# Altium project ESP32_project.PrjPcb
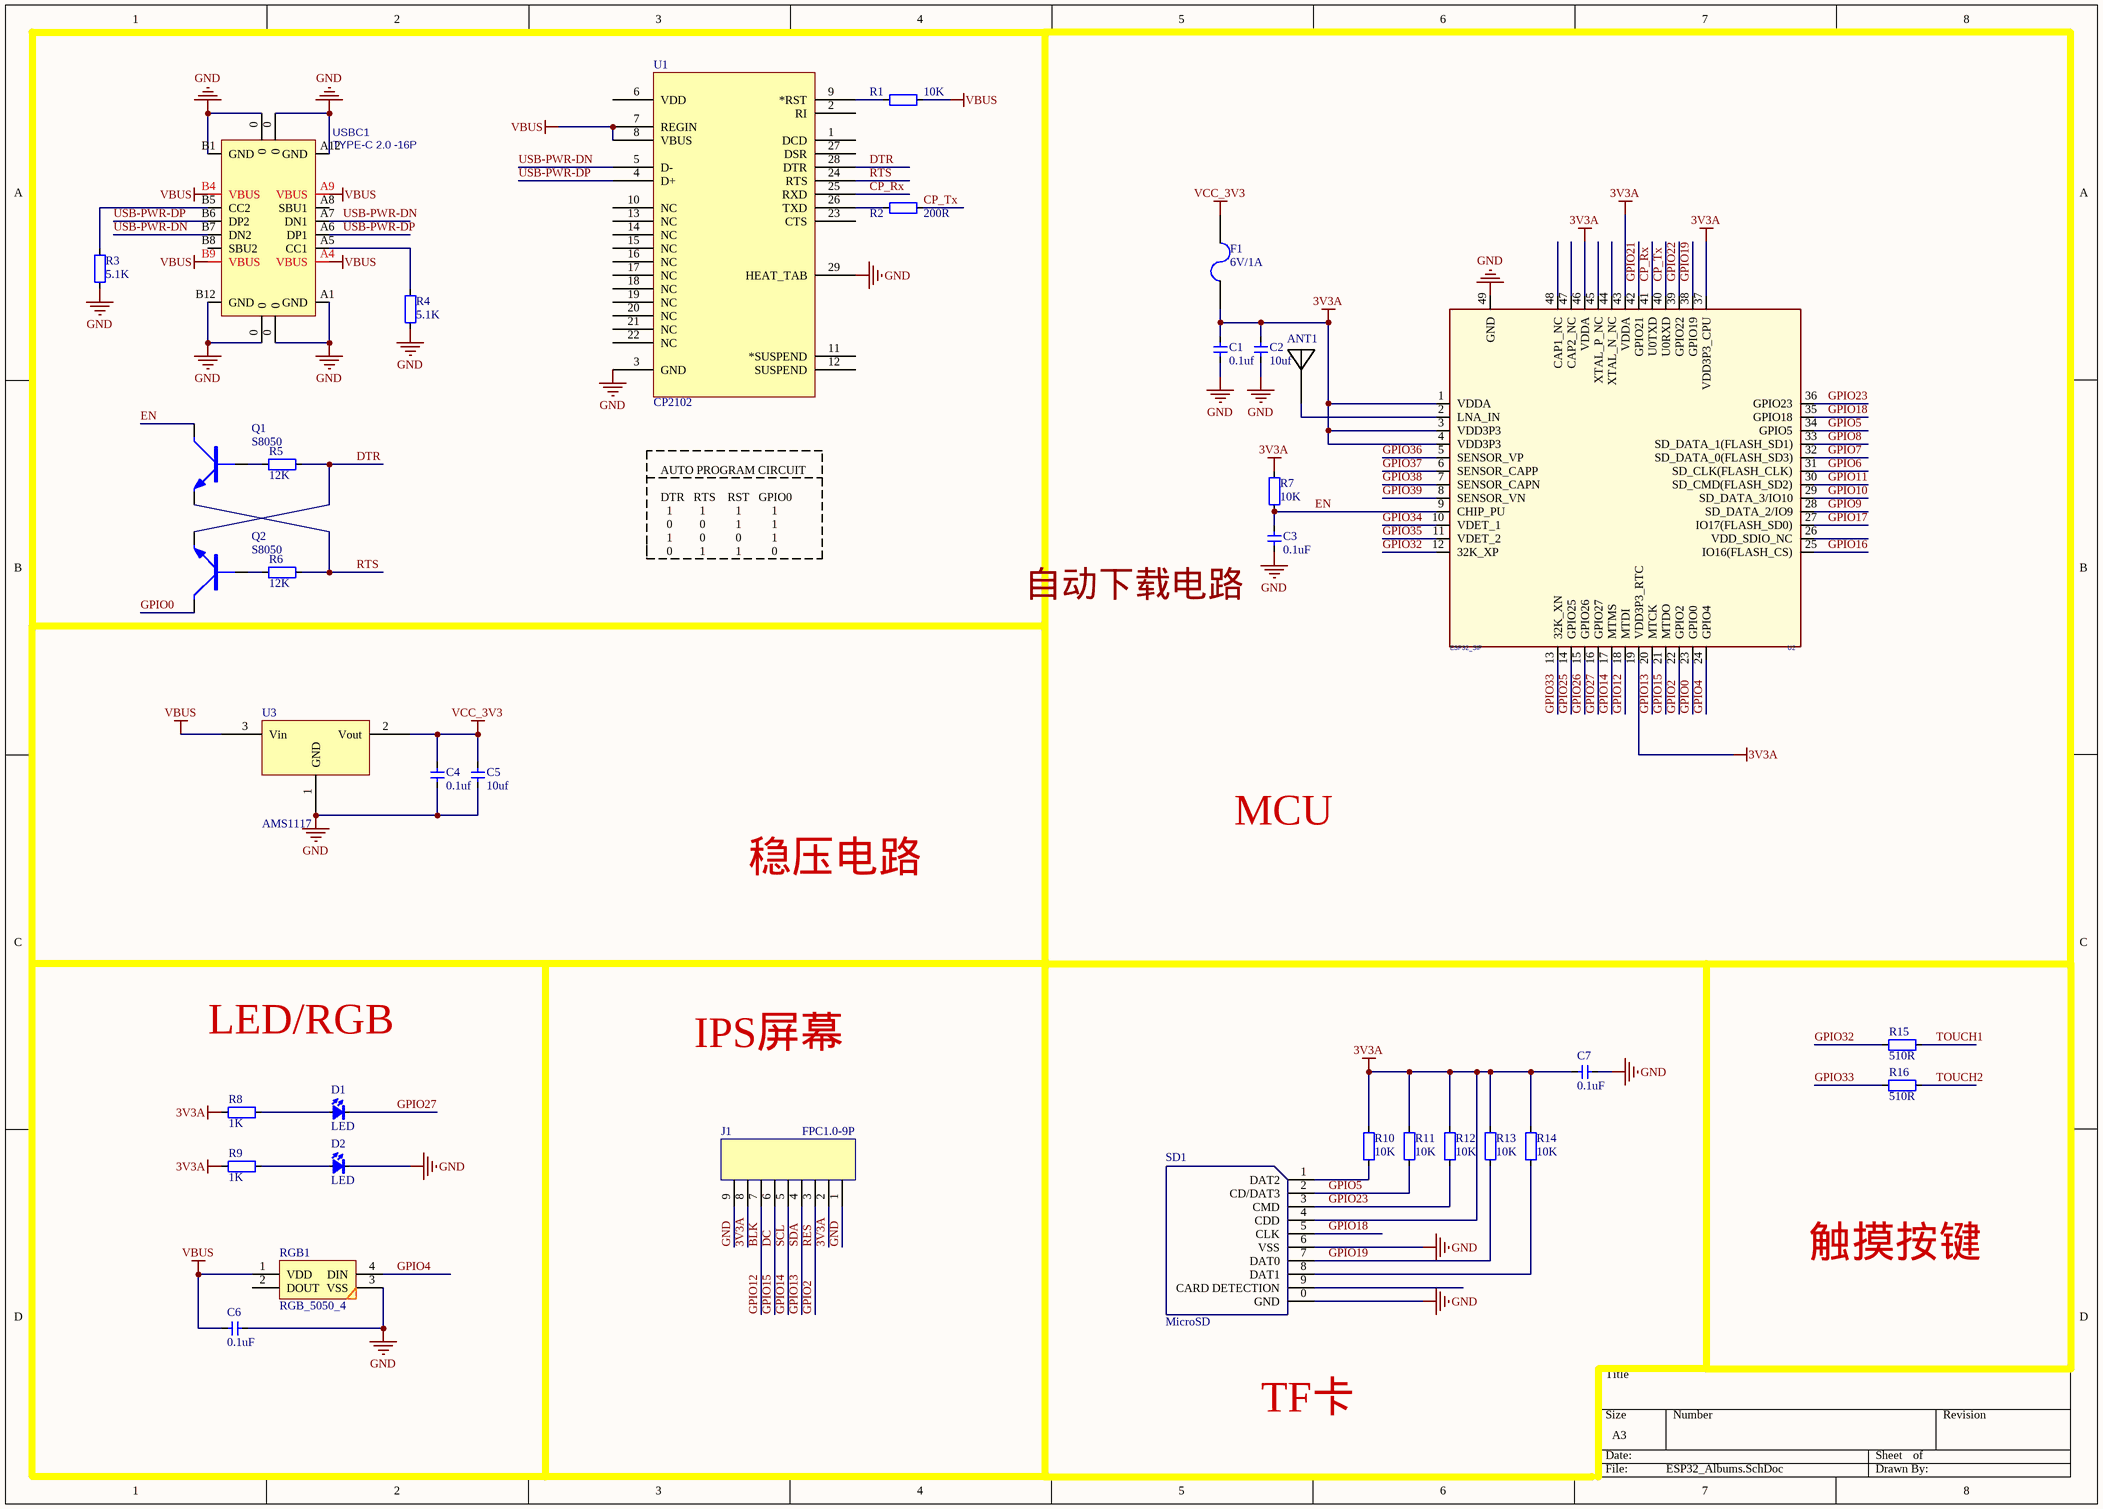
[diagram p0: ESP32_Albums.SchDoc]
1 sheet, 36 parts. Net scope: global (net labels, ports and power ports of the same name join across sheets).
Board file: ESP32_Albums.PcbDoc

## Sheet ESP32_Albums.SchDoc
size A3

### Parts
ANT1  ANT2  [ANT2051]  (value not drawn)
C1  0.1uf  [0603C]
C2  10uf  [0603C]
C3  0.1uF  [0603C]
C4  0.1uf  [0603C]
C5  10uf  [0603C]
C6  0.1uF  [0603C]
C7  0.1uF  [0603C]
D1  LED  [LED_0603_R]
D2  LED  [LED_0603_R]
F1  6V/1A  [FUSE-0805]
J1  FPC1.0-9P  [FPC1.0-9P]
Q1  S8050  [SOT-23]
Q2  S8050  [SOT-23]
R1  10K  [0603R]
R2  200R  [0603R]
R3  5.1K  [0603R]
R4  5.1K  [0603R]
R5  12K  [0603R]
R6  12K  [0603R]
R7  10K  [0603R]
R8  1K  [0603R]
R9  1K  [0603R]
R10  10K  [0603R]
R11  10K  [0603R]
R12  10K  [0603R]
R13  10K  [0603R]
R14  10K  [0603R]
R15  510R  [0603R]
R16  510R  [0603R]
RGB1  RGB_5050_4  [RGB_5050_4]
SD1  MicroSD  [Micro SD]
U1  CP2102  [LC-QFN-28_5x5x05P]
U2  ESP32_SIP  [QFN-48_7X7]
U3  AMS1117  [SOT223]
USBC1  TYPE-C 2.0 -16P  [USB-C-SMD_16P]

### Nets
3V3A: C1.2 C2.2 C7.1 F1.1 J1.2 J1.8 R7.2 R8.1 R9.1 R10.2 R11.2 R12.2 R13.2 R14.2 SD1.4(CDD) U2.1(VDDA) U2.3(VDD3P3) U2.4(VDD3P3) U2.19(VDD3P3_RTC) U2.37(VDD3P3_CPU) U2.43(VDDA) U2.46(VDDA)
GND: C1.1 C2.1 C3.1 C4.1 C5.1 C6.2 C7.2 D2.1(A) J1.1 J1.9 R3.1 R4.1 RGB1.3(VSS) SD1.0(GND) SD1.6(VSS) U1.3(GND) U1.29(HEAT_TAB) U2.49(GND) U3.1(GND) USBC1.0 USBC1.A1(GND) USBC1.A12(GND) USBC1.B1(GND) USBC1.B12(GND)
VBUS: C6.1 R1.2 RGB1.1(VDD) U1.7(REGIN) U1.8(VBUS) U3.3(Vin) USBC1.A4(VBUS) USBC1.A9(VBUS) USBC1.B4(VBUS) USBC1.B9(VBUS)
VCC_3V3: C4.2 C5.2 F1.2 U3.2(Vout)
BLK: J1.7 U2.18(MTDI)  [also labelled GPIO12]
CP_Rx: U1.25(RXD) U2.41(U0TXD)
CP_Tx: R2.2 U2.40(U0RXD)
DC: J1.6 U2.21(MTDO)  [also labelled GPIO15]
DTR: Q2.E R5.2 U1.28(DTR)
EN: C3.2 Q1.C R7.1 U2.9(CHIP_PU)
GPIO0: Q2.C U2.23(GPIO0)
GPIO2: J1.3 U2.22(GPIO2)  [also labelled RES]
GPIO4: RGB1.4(DIN) U2.24(GPIO4)
GPIO5: R11.1 SD1.2(CD/DAT3) U2.34(GPIO5)
GPIO6: U2.31(SD_CLK(FLASH_CLK))
GPIO7: U2.32(SD_DATA_0(FLASH_SD3))
GPIO8: U2.33(SD_DATA_1(FLASH_SD1))
GPIO9: U2.28(SD_DATA_2/IO9)
GPIO10: U2.29(SD_DATA_3/IO10)
GPIO11: U2.30(SD_CMD(FLASH_SD2))
GPIO13: J1.4 U2.20(MTCK)  [also labelled SDA]
GPIO14: J1.5 U2.17(MTMS)  [also labelled SCL]
GPIO16: U2.25(IO16(FLASH_CS))
GPIO17: U2.27(IO17(FLASH_SD0))
GPIO18: SD1.5(CLK) U2.35(GPIO18)
GPIO19: R13.1 SD1.7(DAT0) U2.38(GPIO19)
GPIO21: U2.42(GPIO21)
GPIO22: U2.39(GPIO22)
GPIO23: R12.1 SD1.3(CMD) U2.36(GPIO23)
GPIO25: U2.14(GPIO25)
GPIO26: U2.15(GPIO26)
GPIO27: D1.1(A) U2.16(GPIO27)
GPIO32: R15.1 U2.12(32K_XP)
GPIO33: R16.1 U2.13(32K_XN)
GPIO34: U2.10(VDET_1)
GPIO35: U2.11(VDET_2)
GPIO36: U2.5(SENSOR_VP)
GPIO37: U2.6(SENSOR_CAPP)
GPIO38: U2.7(SENSOR_CAPN)
GPIO39: U2.8(SENSOR_VN)
RTS: Q1.E R6.2 U1.24(RTS)
TOUCH1: R15.2
TOUCH2: R16.2
USB-PWR-DN: U1.5(D-) USBC1.A7(DN1) USBC1.B7(DN2)
USB-PWR-DP: U1.4(D+) USBC1.A6(DP1) USBC1.B6(DP2)
NetANT1_1: ANT1.1 U2.2(LNA_IN)
NetD1_2: D1.2(K) R8.2
NetD2_2: D2.2(K) R9.2
NetQ1_B: Q1.B R5.1
NetQ2_B: Q2.B R6.1
NetR1_1: R1.1 U1.9(*RST)
NetR2_1: R2.1 U1.26(TXD)
NetR3_2: R3.2 USBC1.B5(CC2)
NetR4_2: R4.2 USBC1.A5(CC1)
NetR10_1: R10.1 SD1.1(DAT2)
NetR14_1: R14.1 SD1.8(DAT1)

Not connected (* = marked no-connect by the designer): RGB1 2(DOUT); SD1 9(CARD_DETECTION); U1 1(DCD) 2(RI) 6(VDD) 10(NC) 11(*SUSPEND) 12(SUSPEND) 13(NC) 14(NC) 15(NC) 16(NC) 17(NC) 18(NC) 19(NC) 20(NC) 21(NC) 22(NC) 23(CTS) 27(DSR); U2 26(VDD_SDIO_NC) 44(XTAL_N_NC) 45(XTAL_P_NC) 47(CAP2_NC) 48(CAP1_NC); USBC1 A8(SBU1) B8(SBU2)

### Notes on the sheet
- AUTO PROGRAM CIRCUIT
  DTR   RTS    RST   GPIO0
  1         1          1          1
  0         0          1          1
  1         0          0          1
  0         1          1          0
- 自动下载电路
- MCU
- 稳压电路
- LED/RGB
- IPS屏幕
- 触摸按键
- TF卡

### Library data of the parts
ANT1 = ANT2: 贴片天线
C1-C7 = CAP: 无极性电容
F1 = FUSE
J1 = FPC1.0-9P: 贴片
Q1 Q2 = NPN: NPN三极管
R1-R16 = RES
U1 = CP2102: USB转TTL; PART DESC: SINGLE-CHIP USB TO UART BRIDGE, QFN28, RoHS.; MFG #1: SILICON LABS; PART NUMBER: CP2102; Value: Value; RefDes: RefDes; Type: DEV
U2 = ESP32-PICO
U3 = AMS1117: 三端稳压芯片
USBC1 = USB2.0_Type-C_16Pin: USB2.0 Type-C 16Pin  母座; 联系卖家，免费技术支持: 唯一出售店铺网址https://shop463601444.taobao.com